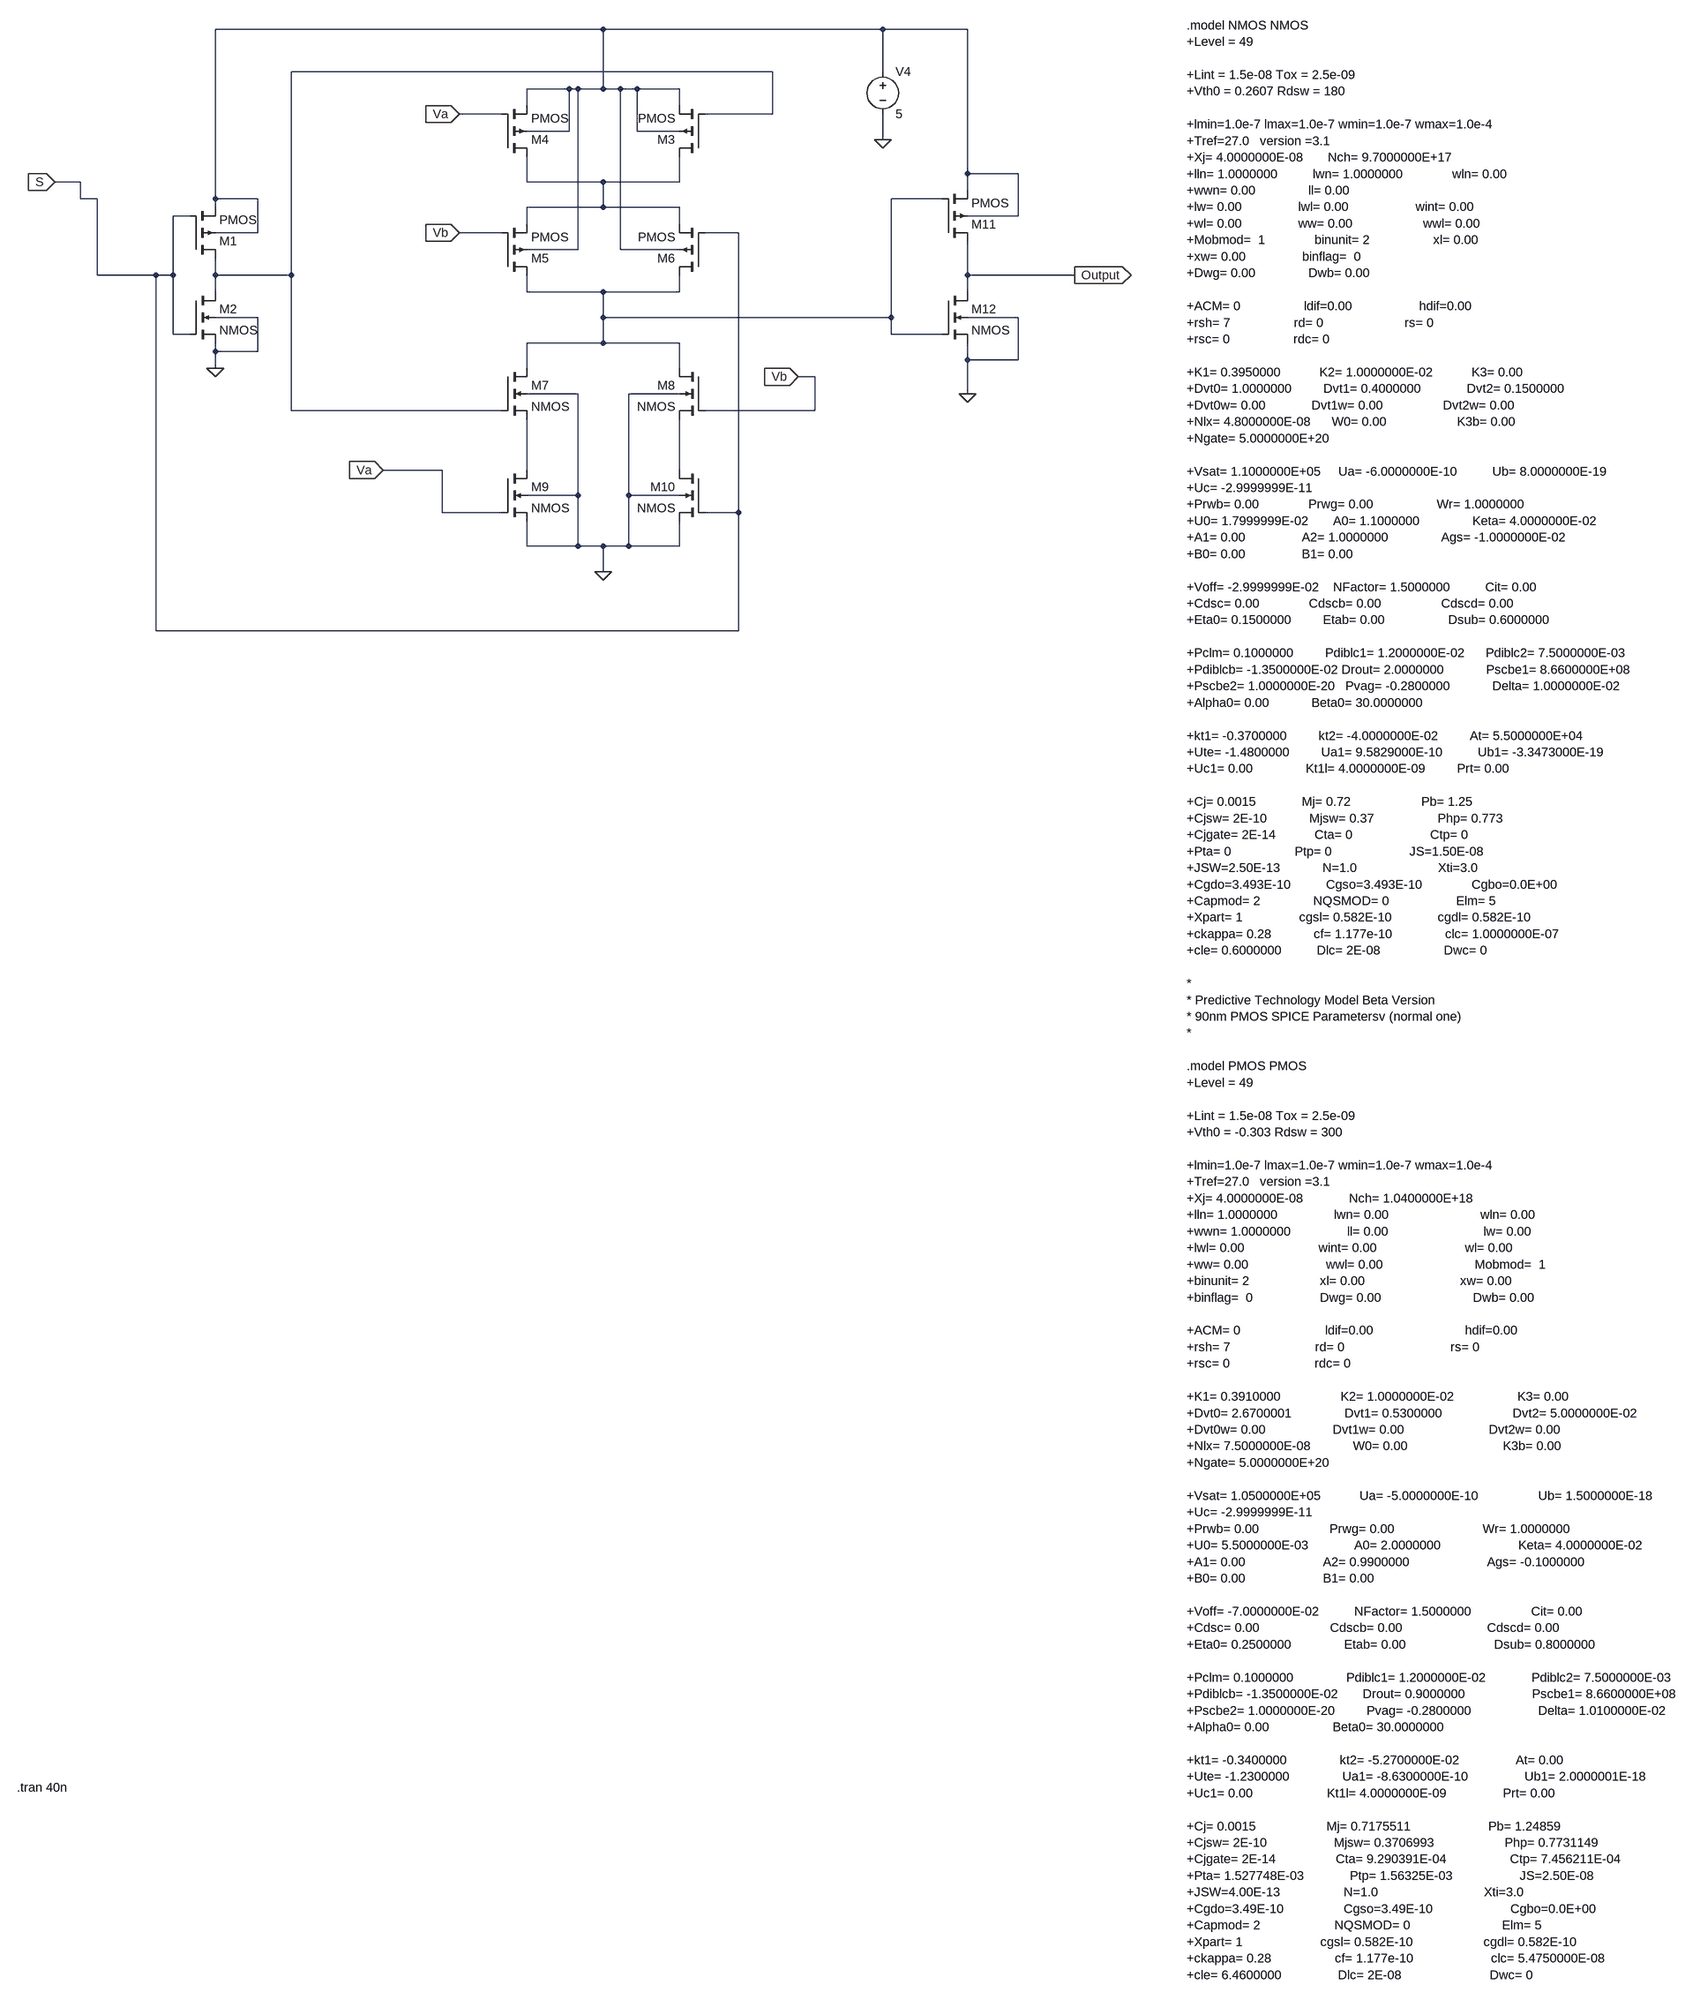
[diagram p0: schematic Draft1.asc]
Draft1.asc, the LTspice schematic file:
Version 4
SHEET 1 3448 3096
WIRE 1248 -240 80 -240
WIRE 1776 -240 1248 -240
WIRE 1936 -240 1776 -240
WIRE 1568 -160 224 -160
WIRE 1776 -160 1776 -240
WIRE 1184 -128 1104 -128
WIRE 1200 -128 1184 -128
WIRE 1248 -128 1248 -240
WIRE 1248 -128 1200 -128
WIRE 1280 -128 1248 -128
WIRE 1312 -128 1280 -128
WIRE 1392 -128 1312 -128
WIRE 1104 -96 1104 -128
WIRE 1392 -96 1392 -128
WIRE 1056 -80 976 -80
WIRE 1568 -80 1568 -160
WIRE 1568 -80 1440 -80
WIRE 1184 -48 1184 -128
WIRE 1184 -48 1104 -48
WIRE 1312 -48 1312 -128
WIRE 1392 -48 1312 -48
WIRE 1776 -32 1776 -80
WIRE 1936 32 1936 -240
WIRE 2032 32 1936 32
WIRE -288 48 -336 48
WIRE 1104 48 1104 0
WIRE 1248 48 1104 48
WIRE 1392 48 1392 0
WIRE 1392 48 1248 48
WIRE 1936 64 1936 32
WIRE -288 80 -288 48
WIRE -256 80 -288 80
WIRE 80 80 80 -240
WIRE 160 80 80 80
WIRE 1888 80 1792 80
WIRE 80 96 80 80
WIRE 1248 96 1248 48
WIRE 1248 96 1104 96
WIRE 1392 96 1248 96
WIRE 32 112 0 112
WIRE 2032 112 2032 32
WIRE 2032 112 1936 112
WIRE 1104 128 1104 96
WIRE 1392 128 1392 96
WIRE 160 144 160 80
WIRE 160 144 80 144
WIRE 1056 144 976 144
WIRE 1504 144 1440 144
WIRE 1200 176 1200 -128
WIRE 1200 176 1104 176
WIRE 1280 176 1280 -128
WIRE 1392 176 1280 176
WIRE -256 224 -256 80
WIRE -32 224 -256 224
WIRE 0 224 0 112
WIRE 0 224 -32 224
WIRE 80 224 80 192
WIRE 224 224 224 -160
WIRE 224 224 80 224
WIRE 1936 224 1936 160
WIRE 2144 224 1936 224
WIRE 80 256 80 224
WIRE 1104 256 1104 224
WIRE 1248 256 1104 256
WIRE 1392 256 1392 224
WIRE 1392 256 1248 256
WIRE 1936 256 1936 224
WIRE 160 304 80 304
WIRE 1248 304 1248 256
WIRE 1792 304 1792 80
WIRE 1792 304 1248 304
WIRE 2032 304 1936 304
WIRE 0 336 0 224
WIRE 32 336 0 336
WIRE 1792 336 1792 304
WIRE 1888 336 1792 336
WIRE 1248 352 1248 304
WIRE 1248 352 1104 352
WIRE 1392 352 1248 352
WIRE 80 368 80 352
WIRE 160 368 160 304
WIRE 160 368 80 368
WIRE 1936 384 1936 352
WIRE 2032 384 2032 304
WIRE 2032 384 1936 384
WIRE 80 400 80 368
WIRE 1104 400 1104 352
WIRE 1392 400 1392 352
WIRE 1648 416 1616 416
WIRE 1200 448 1104 448
WIRE 1392 448 1296 448
WIRE 1936 448 1936 384
WIRE 224 480 224 224
WIRE 1056 480 224 480
WIRE 1648 480 1648 416
WIRE 1648 480 1440 480
WIRE 944 592 832 592
WIRE 1104 592 1104 496
WIRE 1392 592 1392 496
WIRE 1200 640 1200 448
WIRE 1200 640 1104 640
WIRE 1296 640 1296 448
WIRE 1392 640 1296 640
WIRE 944 672 944 592
WIRE 1056 672 944 672
WIRE 1504 672 1504 144
WIRE 1504 672 1440 672
WIRE 1104 736 1104 688
WIRE 1200 736 1200 640
WIRE 1200 736 1104 736
WIRE 1248 736 1200 736
WIRE 1296 736 1296 640
WIRE 1296 736 1248 736
WIRE 1392 736 1392 688
WIRE 1392 736 1296 736
WIRE 1248 784 1248 736
WIRE -32 896 -32 224
WIRE 1504 896 1504 672
WIRE 1504 896 -32 896
FLAG -336 48 S
IOPIN -336 48 In
FLAG 80 400 0
FLAG 976 -80 Va
IOPIN 976 -80 In
FLAG 976 144 Vb
IOPIN 976 144 In
FLAG 1248 784 0
FLAG 832 592 Va
IOPIN 832 592 In
FLAG 1616 416 Vb
IOPIN 1616 416 In
FLAG 1776 -32 0
FLAG 1936 448 0
FLAG 2144 224 Output
IOPIN 2144 224 Out
SYMBOL nmos4 32 256 R0
SYMATTR InstName M2
SYMATTR Value2 l=180n w=360n
SYMBOL pmos4 32 192 M180
SYMATTR InstName M1
SYMATTR Value2 l=180n w=720n
SYMBOL pmos4 1440 0 R180
SYMATTR InstName M3
SYMATTR Value2 l=180n w=720n
SYMBOL pmos4 1056 0 M180
SYMATTR InstName M4
SYMATTR Value2 l=180n w=720n
SYMBOL pmos4 1056 224 M180
SYMATTR InstName M5
SYMATTR Value2 l=180n w=720n
SYMBOL pmos4 1440 224 R180
SYMATTR InstName M6
SYMATTR Value2 l=180n w=720n
SYMBOL nmos4 1056 400 R0
SYMATTR InstName M7
SYMATTR Value2 l=180n w=360n
SYMBOL nmos4 1440 400 M0
SYMATTR InstName M8
SYMATTR Value2 l=180n w=360n
SYMBOL nmos4 1056 592 R0
SYMATTR InstName M9
SYMATTR Value2 l=180n w=360n
SYMBOL nmos4 1440 592 M0
SYMATTR InstName M10
SYMATTR Value2 l=180n w=360n
SYMBOL voltage 1776 -176 R0
WINDOW 123 0 0 Left 0
WINDOW 39 0 0 Left 0
SYMATTR InstName V4
SYMATTR Value 5
SYMBOL pmos4 1888 160 M180
SYMATTR InstName M11
SYMATTR Value2 l=180n w=720n
SYMBOL nmos4 1888 256 R0
SYMATTR InstName M12
SYMATTR Value2 l=180n w=360n
TEXT 2432 -248 Left 2 !.model NMOS NMOS\n+Level = 49\n \n+Lint = 1.5e-08 Tox = 2.5e-09 \n+Vth0 = 0.2607 Rdsw = 180 \n \n+lmin=1.0e-7 lmax=1.0e-7 wmin=1.0e-7 wmax=1.0e-4\n+Tref=27.0   version =3.1\n+Xj= 4.0000000E-08       Nch= 9.7000000E+17 \n+lln= 1.0000000          lwn= 1.0000000              wln= 0.00\n+wwn= 0.00               ll= 0.00\n+lw= 0.00                lwl= 0.00                   wint= 0.00\n+wl= 0.00                ww= 0.00                    wwl= 0.00\n+Mobmod=  1              binunit= 2                  xl= 0.00\n+xw= 0.00                binflag=  0\n+Dwg= 0.00               Dwb= 0.00 \n \n+ACM= 0                  ldif=0.00                   hdif=0.00\n+rsh= 7                  rd= 0                       rs= 0\n+rsc= 0                  rdc= 0\n \n+K1= 0.3950000           K2= 1.0000000E-02           K3= 0.00 \n+Dvt0= 1.0000000         Dvt1= 0.4000000             Dvt2= 0.1500000 \n+Dvt0w= 0.00             Dvt1w= 0.00                 Dvt2w= 0.00 \n+Nlx= 4.8000000E-08      W0= 0.00                    K3b= 0.00 \n+Ngate= 5.0000000E+20 \n \n+Vsat= 1.1000000E+05     Ua= -6.0000000E-10          Ub= 8.0000000E-19 \n+Uc= -2.9999999E-11       \n+Prwb= 0.00              Prwg= 0.00                  Wr= 1.0000000 \n+U0= 1.7999999E-02       A0= 1.1000000               Keta= 4.0000000E-02 \n+A1= 0.00                A2= 1.0000000               Ags= -1.0000000E-02\n+B0= 0.00                B1= 0.00 \n \n+Voff= -2.9999999E-02    NFactor= 1.5000000          Cit= 0.00 \n+Cdsc= 0.00              Cdscb= 0.00                 Cdscd= 0.00 \n+Eta0= 0.1500000         Etab= 0.00                  Dsub= 0.6000000 \n \n+Pclm= 0.1000000         Pdiblc1= 1.2000000E-02      Pdiblc2= 7.5000000E-03\n+Pdiblcb= -1.3500000E-02 Drout= 2.0000000            Pscbe1= 8.6600000E+08\n+Pscbe2= 1.0000000E-20   Pvag= -0.2800000            Delta= 1.0000000E-02\n+Alpha0= 0.00            Beta0= 30.0000000 \n \n+kt1= -0.3700000         kt2= -4.0000000E-02         At= 5.5000000E+04 \n+Ute= -1.4800000         Ua1= 9.5829000E-10          Ub1= -3.3473000E-19\n+Uc1= 0.00               Kt1l= 4.0000000E-09         Prt= 0.00 \n \n+Cj= 0.0015             Mj= 0.72                    Pb= 1.25 \n+Cjsw= 2E-10            Mjsw= 0.37                  Php= 0.773\n+Cjgate= 2E-14           Cta= 0                      Ctp= 0\n+Pta= 0                  Ptp= 0                      JS=1.50E-08\n+JSW=2.50E-13            N=1.0                       Xti=3.0\n+Cgdo=3.493E-10          Cgso=3.493E-10              Cgbo=0.0E+00\n+Capmod= 2               NQSMOD= 0                   Elm= 5\n+Xpart= 1                cgsl= 0.582E-10             cgdl= 0.582E-10\n+ckappa= 0.28            cf= 1.177e-10               clc= 1.0000000E-07\n+cle= 0.6000000          Dlc= 2E-08                  Dwc= 0\n \n*\n* Predictive Technology Model Beta Version\n* 90nm PMOS SPICE Parametersv (normal one)\n*\n \n.model PMOS PMOS\n+Level = 49\n \n+Lint = 1.5e-08 Tox = 2.5e-09 \n+Vth0 = -0.303 Rdsw = 300 \n \n+lmin=1.0e-7 lmax=1.0e-7 wmin=1.0e-7 wmax=1.0e-4\n+Tref=27.0   version =3.1\n+Xj= 4.0000000E-08             Nch= 1.0400000E+18 \n+lln= 1.0000000                lwn= 0.00                          wln= 0.00\n+wwn= 1.0000000                ll= 0.00                           lw= 0.00\n+lwl= 0.00                     wint= 0.00                         wl= 0.00\n+ww= 0.00                      wwl= 0.00                          Mobmod=  1\n+binunit= 2                    xl= 0.00                           xw= 0.00\n+binflag=  0                   Dwg= 0.00                          Dwb= 0.00\n \n+ACM= 0                        ldif=0.00                          hdif=0.00\n+rsh= 7                        rd= 0                              rs= 0\n+rsc= 0                        rdc= 0\n \n+K1= 0.3910000                 K2= 1.0000000E-02                  K3= 0.00 \n+Dvt0= 2.6700001               Dvt1= 0.5300000                    Dvt2= 5.0000000E-02 \n+Dvt0w= 0.00                   Dvt1w= 0.00                        Dvt2w= 0.00 \n+Nlx= 7.5000000E-08            W0= 0.00                           K3b= 0.00 \n+Ngate= 5.0000000E+20 \n \n+Vsat= 1.0500000E+05           Ua= -5.0000000E-10                 Ub= 1.5000000E-18\n+Uc= -2.9999999E-11  \n+Prwb= 0.00                    Prwg= 0.00                         Wr= 1.0000000 \n+U0= 5.5000000E-03             A0= 2.0000000                      Keta= 4.0000000E-02\n+A1= 0.00                      A2= 0.9900000                      Ags= -0.1000000 \n+B0= 0.00                      B1= 0.00 \n \n+Voff= -7.0000000E-02          NFactor= 1.5000000                 Cit= 0.00 \n+Cdsc= 0.00                    Cdscb= 0.00                        Cdscd= 0.00\n+Eta0= 0.2500000               Etab= 0.00                         Dsub= 0.8000000 \n \n+Pclm= 0.1000000               Pdiblc1= 1.2000000E-02             Pdiblc2= 7.5000000E-03 \n+Pdiblcb= -1.3500000E-02       Drout= 0.9000000                   Pscbe1= 8.6600000E+08 \n+Pscbe2= 1.0000000E-20         Pvag= -0.2800000                   Delta= 1.0100000E-02 \n+Alpha0= 0.00                  Beta0= 30.0000000 \n \n+kt1= -0.3400000               kt2= -5.2700000E-02                At= 0.00 \n+Ute= -1.2300000               Ua1= -8.6300000E-10                Ub1= 2.0000001E-18 \n+Uc1= 0.00                     Kt1l= 4.0000000E-09                Prt= 0.00 \n \n+Cj= 0.0015                    Mj= 0.7175511                      Pb= 1.24859\n+Cjsw= 2E-10                   Mjsw= 0.3706993                    Php= 0.7731149\n+Cjgate= 2E-14                 Cta= 9.290391E-04                  Ctp= 7.456211E-04\n+Pta= 1.527748E-03             Ptp= 1.56325E-03                   JS=2.50E-08\n+JSW=4.00E-13                  N=1.0                              Xti=3.0\n+Cgdo=3.49E-10                 Cgso=3.49E-10                      Cgbo=0.0E+00       \n+Capmod= 2                     NQSMOD= 0                          Elm= 5            \n+Xpart= 1                      cgsl= 0.582E-10                    cgdl= 0.582E-10\n+ckappa= 0.28                  cf= 1.177e-10                      clc= 5.4750000E-08 \n+cle= 6.4600000                Dlc= 2E-08                         Dwc= 0
TEXT -408 3080 Left 2 !.tran 40n

The netlist it stands for:
* Draft1.asc
M2 N002 S 0 0 NMOS l=180n w=360n
M1 N002 S N001 N001 PMOS l=180n w=720n
M3 N003 N002 N001 N001 PMOS l=180n w=720n
M4 N003 Va N001 N001 PMOS l=180n w=720n
M5 N004 Vb N003 N001 PMOS l=180n w=720n
M6 N004 S N003 N001 PMOS l=180n w=720n
M7 N004 N002 N005 0 NMOS l=180n w=360n
M8 N004 Vb N006 0 NMOS l=180n w=360n
M9 N005 Va 0 0 NMOS l=180n w=360n
M10 N006 S 0 0 NMOS l=180n w=360n
V4 N001 0 5
M11 Output N004 N001 N001 PMOS l=180n w=720n
M12 Output N004 0 0 NMOS l=180n w=360n
.model NMOS NMOS
.model PMOS PMOS
.lib standard.mos
.model NMOS NMOS
+Level = 49
+Lint = 1.5e-08 Tox = 2.5e-09
+Vth0 = 0.2607 Rdsw = 180
+lmin=1.0e-7 lmax=1.0e-7 wmin=1.0e-7 wmax=1.0e-4
+Tref=27.0   version =3.1
+Xj= 4.0000000E-08       Nch= 9.7000000E+17
+lln= 1.0000000          lwn= 1.0000000              wln= 0.00
+wwn= 0.00               ll= 0.00
+lw= 0.00                lwl= 0.00                   wint= 0.00
+wl= 0.00                ww= 0.00                    wwl= 0.00
+Mobmod=  1              binunit= 2                  xl= 0.00
+xw= 0.00                binflag=  0
+Dwg= 0.00               Dwb= 0.00
+ACM= 0                  ldif=0.00                   hdif=0.00
+rsh= 7                  rd= 0                       rs= 0
+rsc= 0                  rdc= 0
+K1= 0.3950000           K2= 1.0000000E-02           K3= 0.00
+Dvt0= 1.0000000         Dvt1= 0.4000000             Dvt2= 0.1500000
+Dvt0w= 0.00             Dvt1w= 0.00                 Dvt2w= 0.00
+Nlx= 4.8000000E-08      W0= 0.00                    K3b= 0.00
+Ngate= 5.0000000E+20
+Vsat= 1.1000000E+05     Ua= -6.0000000E-10          Ub= 8.0000000E-19
+Uc= -2.9999999E-11
+Prwb= 0.00              Prwg= 0.00                  Wr= 1.0000000
+U0= 1.7999999E-02       A0= 1.1000000               Keta= 4.0000000E-02
+A1= 0.00                A2= 1.0000000               Ags= -1.0000000E-02
+B0= 0.00                B1= 0.00
+Voff= -2.9999999E-02    NFactor= 1.5000000          Cit= 0.00
+Cdsc= 0.00              Cdscb= 0.00                 Cdscd= 0.00
+Eta0= 0.1500000         Etab= 0.00                  Dsub= 0.6000000
+Pclm= 0.1000000         Pdiblc1= 1.2000000E-02      Pdiblc2= 7.5000000E-03
+Pdiblcb= -1.3500000E-02 Drout= 2.0000000            Pscbe1= 8.6600000E+08
+Pscbe2= 1.0000000E-20   Pvag= -0.2800000            Delta= 1.0000000E-02
+Alpha0= 0.00            Beta0= 30.0000000
+kt1= -0.3700000         kt2= -4.0000000E-02         At= 5.5000000E+04
+Ute= -1.4800000         Ua1= 9.5829000E-10          Ub1= -3.3473000E-19
+Uc1= 0.00               Kt1l= 4.0000000E-09         Prt= 0.00
+Cj= 0.0015             Mj= 0.72                    Pb= 1.25
+Cjsw= 2E-10            Mjsw= 0.37                  Php= 0.773
+Cjgate= 2E-14           Cta= 0                      Ctp= 0
+Pta= 0                  Ptp= 0                      JS=1.50E-08
+JSW=2.50E-13            N=1.0                       Xti=3.0
+Cgdo=3.493E-10          Cgso=3.493E-10              Cgbo=0.0E+00
+Capmod= 2               NQSMOD= 0                   Elm= 5
+Xpart= 1                cgsl= 0.582E-10             cgdl= 0.582E-10
+ckappa= 0.28            cf= 1.177e-10               clc= 1.0000000E-07
+cle= 0.6000000          Dlc= 2E-08                  Dwc= 0
*
* Predictive Technology Model Beta Version
* 90nm PMOS SPICE Parametersv (normal one)
*
.model PMOS PMOS
+Level = 49
+Lint = 1.5e-08 Tox = 2.5e-09
+Vth0 = -0.303 Rdsw = 300
+lmin=1.0e-7 lmax=1.0e-7 wmin=1.0e-7 wmax=1.0e-4
+Tref=27.0   version =3.1
+Xj= 4.0000000E-08             Nch= 1.0400000E+18
+lln= 1.0000000                lwn= 0.00                          wln= 0.00
+wwn= 1.0000000                ll= 0.00                           lw= 0.00
+lwl= 0.00                     wint= 0.00                         wl= 0.00
+ww= 0.00                      wwl= 0.00                          Mobmod=  1
+binunit= 2                    xl= 0.00                           xw= 0.00
+binflag=  0                   Dwg= 0.00                          Dwb= 0.00
+ACM= 0                        ldif=0.00                          hdif=0.00
+rsh= 7                        rd= 0                              rs= 0
+rsc= 0                        rdc= 0
+K1= 0.3910000                 K2= 1.0000000E-02                  K3= 0.00
+Dvt0= 2.6700001               Dvt1= 0.5300000                    Dvt2= 5.0000000E-02
+Dvt0w= 0.00                   Dvt1w= 0.00                        Dvt2w= 0.00
+Nlx= 7.5000000E-08            W0= 0.00                           K3b= 0.00
+Ngate= 5.0000000E+20
+Vsat= 1.0500000E+05           Ua= -5.0000000E-10                 Ub= 1.5000000E-18
+Uc= -2.9999999E-11
+Prwb= 0.00                    Prwg= 0.00                         Wr= 1.0000000
+U0= 5.5000000E-03             A0= 2.0000000                      Keta= 4.0000000E-02
+A1= 0.00                      A2= 0.9900000                      Ags= -0.1000000
+B0= 0.00                      B1= 0.00
+Voff= -7.0000000E-02          NFactor= 1.5000000                 Cit= 0.00
+Cdsc= 0.00                    Cdscb= 0.00                        Cdscd= 0.00
+Eta0= 0.2500000               Etab= 0.00                         Dsub= 0.8000000
+Pclm= 0.1000000               Pdiblc1= 1.2000000E-02             Pdiblc2= 7.5000000E-03
+Pdiblcb= -1.3500000E-02       Drout= 0.9000000                   Pscbe1= 8.6600000E+08
+Pscbe2= 1.0000000E-20         Pvag= -0.2800000                   Delta= 1.0100000E-02
+Alpha0= 0.00                  Beta0= 30.0000000
+kt1= -0.3400000               kt2= -5.2700000E-02                At= 0.00
+Ute= -1.2300000               Ua1= -8.6300000E-10                Ub1= 2.0000001E-18
+Uc1= 0.00                     Kt1l= 4.0000000E-09                Prt= 0.00
+Cj= 0.0015                    Mj= 0.7175511                      Pb= 1.24859
+Cjsw= 2E-10                   Mjsw= 0.3706993                    Php= 0.7731149
+Cjgate= 2E-14                 Cta= 9.290391E-04                  Ctp= 7.456211E-04
+Pta= 1.527748E-03             Ptp= 1.56325E-03                   JS=2.50E-08
+JSW=4.00E-13                  N=1.0                              Xti=3.0
+Cgdo=3.49E-10                 Cgso=3.49E-10                      Cgbo=0.0E+00
+Capmod= 2                     NQSMOD= 0                          Elm= 5
+Xpart= 1                      cgsl= 0.582E-10                    cgdl= 0.582E-10
+ckappa= 0.28                  cf= 1.177e-10                      clc= 5.4750000E-08
+cle= 6.4600000                Dlc= 2E-08                         Dwc= 0
.tran 40n
.backanno
.end